# Altium schematic sheet 稳压板STM32.SchDoc
size A2
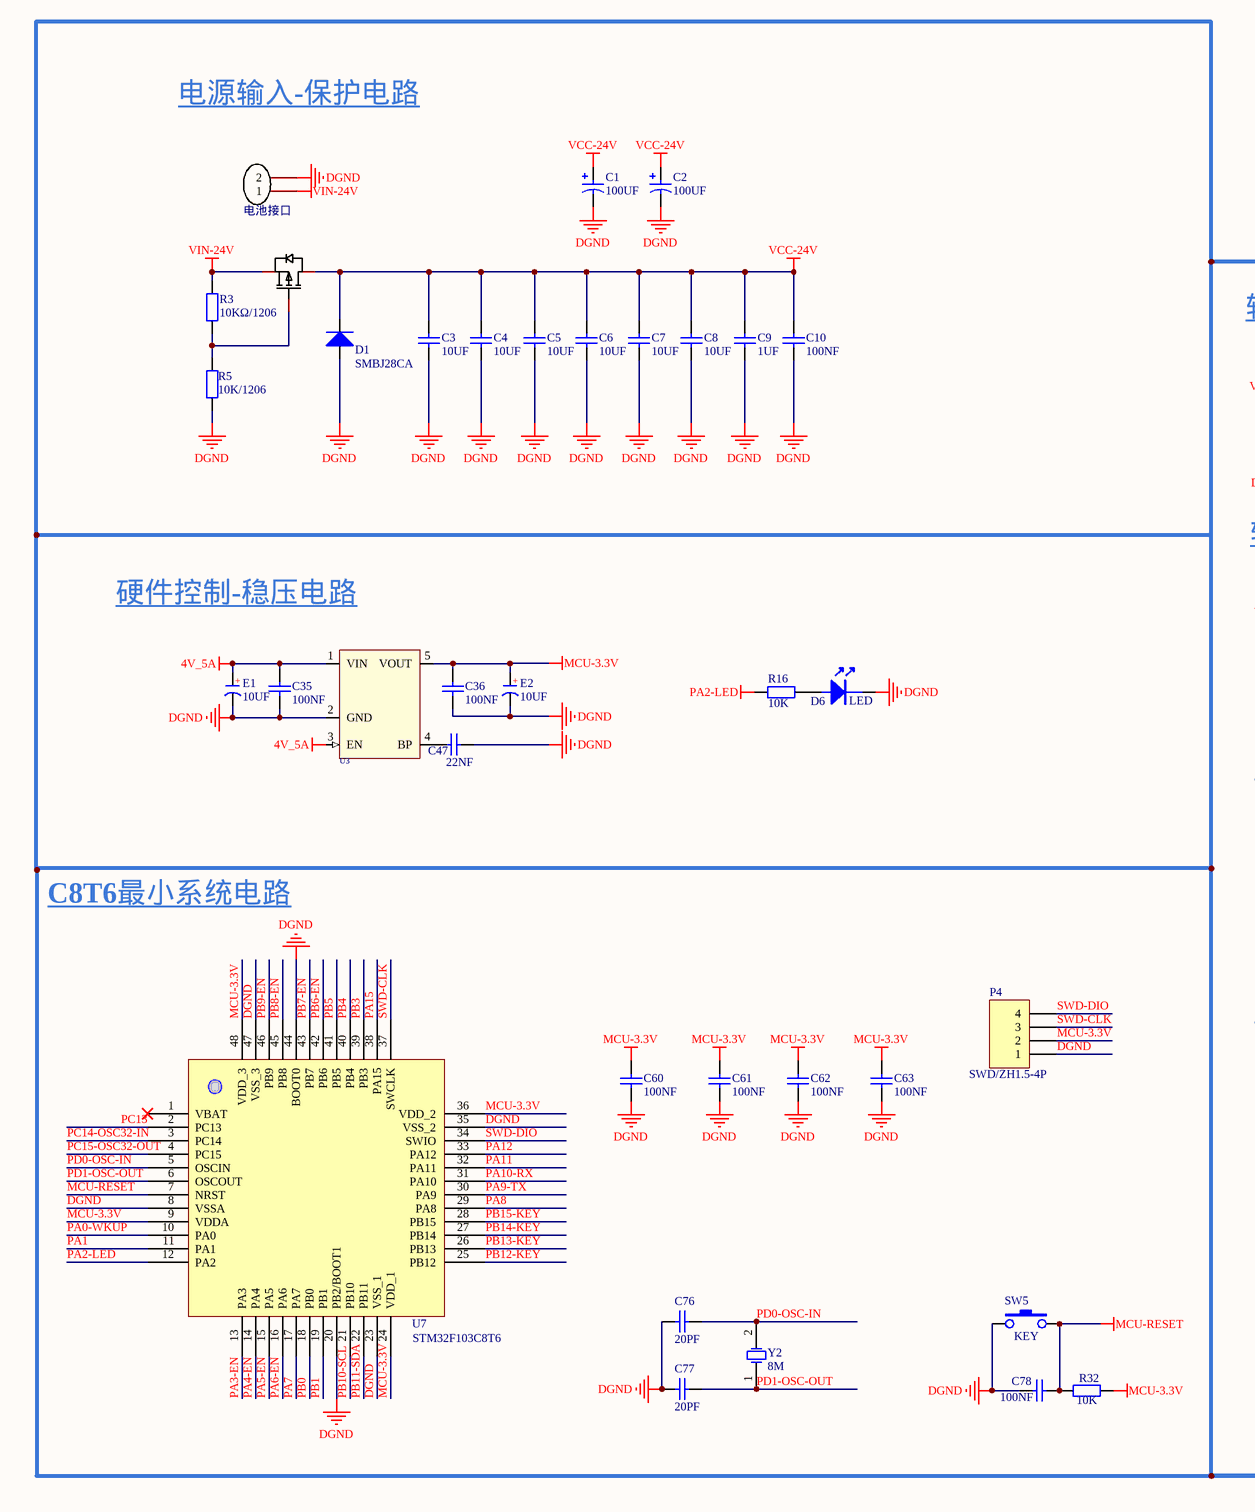
[diagram p0: 稳压板STM32.SchDoc, left]
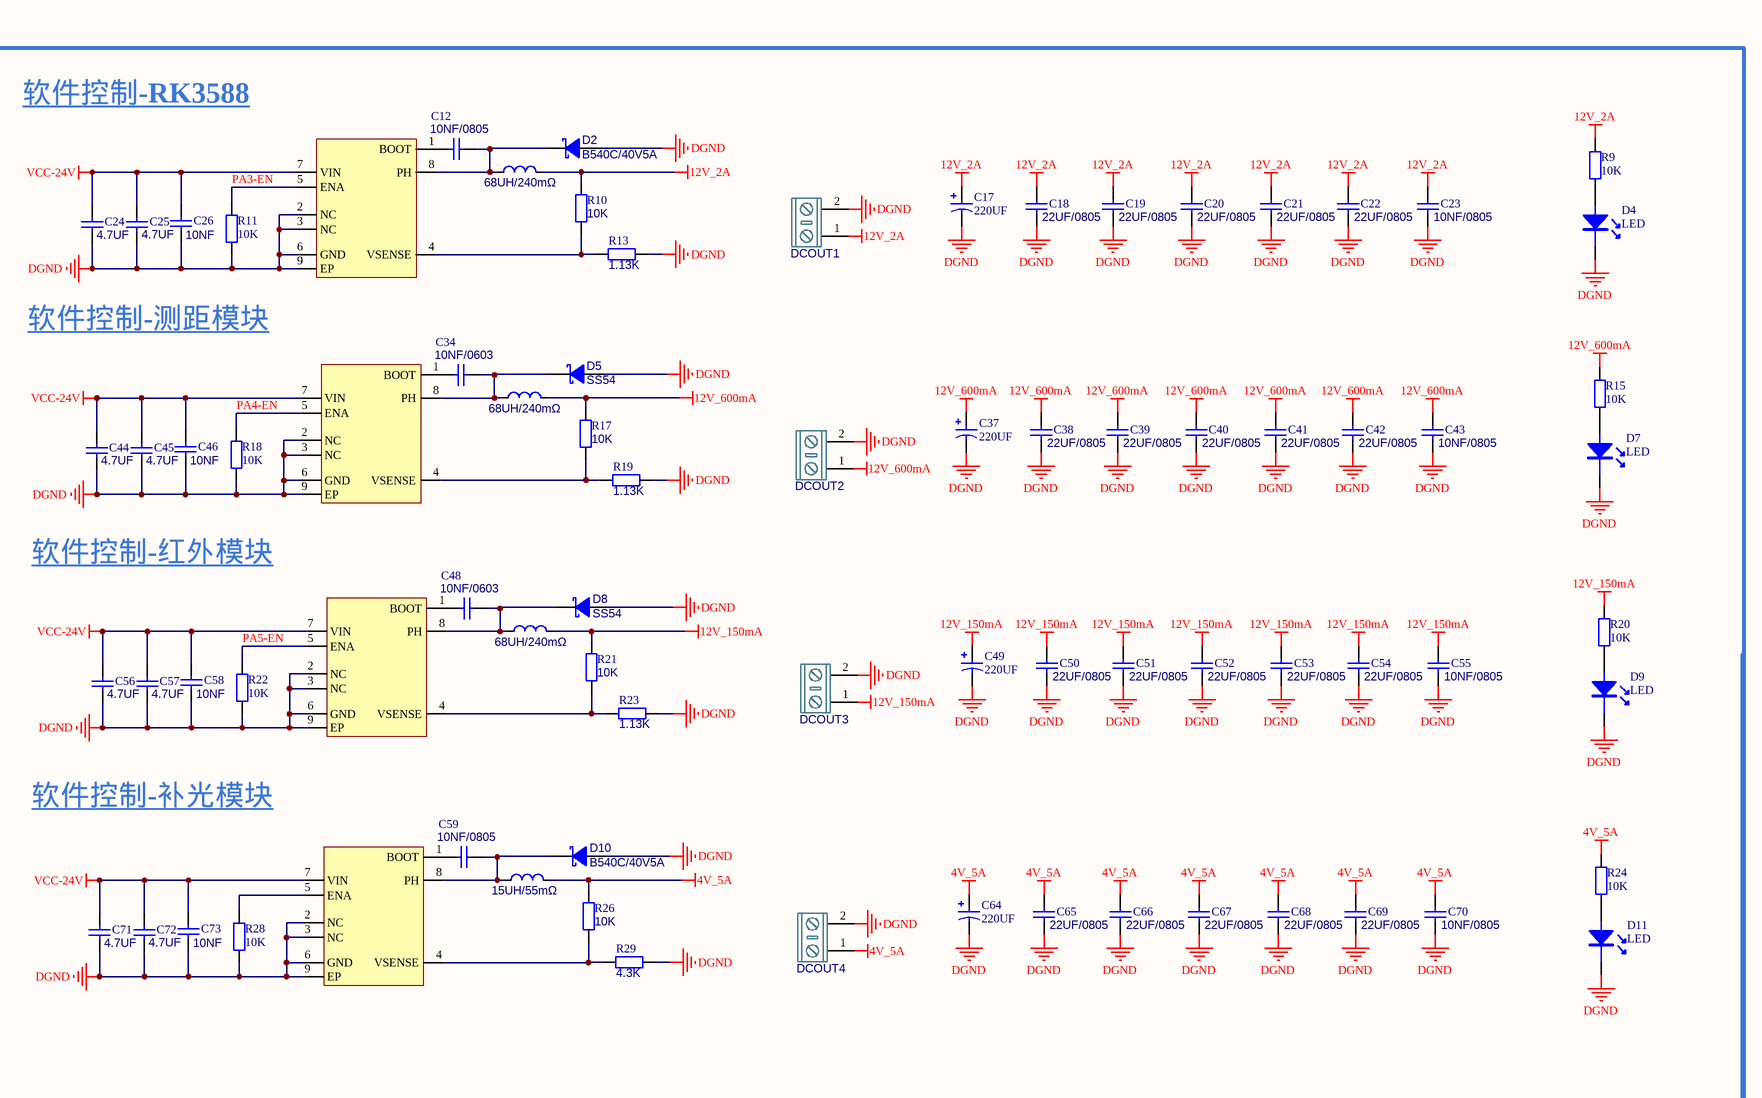
[diagram p1: 稳压板STM32.SchDoc, right]

## Parts
1  68UH/240mΩ  [IND-SMD_L11.5-W10.0_SMMS1040]
3  68UH/240mΩ  [IND-SMD_L11.5-W10.0_SMMS1040]
4  68UH/240mΩ  [IND-SMD_L11.5-W10.0_SMMS1040]
5  15UH/55mΩ  [IND-SMD_L11.5-W10.0_SMMS1040]
C1  100UF  [CM D(6.3*7.7)]
C2  100UF  [CM D(6.3*7.7)]
C3  10UF  [C0603]
C4  10UF  [C0603]
C5  10UF  [C0603]
C6  10UF  [C0603]
C7  10UF  [C0603]
C8  10UF  [C0603]
C9  1UF  [C0603]
C10  100NF  [C0603]
C12  10NF/0805  [C0805]
C17  220UF  [CM F(10*10.2)]
C18  22UF/0805  [C0805]
C19  22UF/0805  [C0805]
C20  22UF/0805  [C0805]
C21  22UF/0805  [C0805]
C22  22UF/0805  [C0805]
C23  10NF/0805  [C0805]
C24  4.7UF  [C1812]
C25  4.7UF  [C1812]
C26  10NF  [C0805]
C34  10NF/0603  [C0603]
C35  100NF  [C0603]
C36  100NF  [C0603]
C37  220UF  [CM F(10*10.2)]
C38  22UF/0805  [C0805]
C39  22UF/0805  [C0805]
C40  22UF/0805  [C0805]
C41  22UF/0805  [C0805]
C42  22UF/0805  [C0805]
C43  10NF/0805  [C0805]
C44  4.7UF  [C0603]
C45  4.7UF  [C0603]
C46  10NF  [C0603]
C47  22NF  [C0603]
C48  10NF/0603  [C0603]
C49  220UF  [CM F(10*10.2)]
C50  22UF/0805  [C0805]
C51  22UF/0805  [C0805]
C52  22UF/0805  [C0805]
C53  22UF/0805  [C0805]
C54  22UF/0805  [C0805]
C55  10NF/0805  [C0805]
C56  4.7UF  [C0603]
C57  4.7UF  [C0603]
C58  10NF  [C0603]
C59  10NF/0805  [C0805]
C60  100NF  [C0603]
C61  100NF  [C0603]
C62  100NF  [C0603]
C63  100NF  [C0603]
C64  220UF  [CM F(10*10.2)]
C65  22UF/0805  [C0805]
C66  22UF/0805  [C0805]
C67  22UF/0805  [C0805]
C68  22UF/0805  [C0805]
C69  22UF/0805  [C0805]
C70  10NF/0805  [C0805]
C71  4.7UF  [C1812]
C72  4.7UF  [C1812]
C73  10NF  [C0805]
C76  20PF  [C0603]
C77  20PF  [C0603]
C78  100NF  [C0603]
D1  SMBJ28CA  [SMB]
D2  B540C/40V5A  [SMC]
D4  LED  [LEDC1608(0603)-L]
D5  SS54  [SMA]
D6  LED  [LEDC1608(0603)-L]
D7  LED  [LEDC1608(0603)-L]
D8  SS54  [SMA]
D9  LED  [LEDC1608(0603)-L]
D10  B540C/40V5A  [SMC]
D11  LED  [LEDC1608(0603)-L]
DCOUT1  KF/WJ/DG 30x connecter  [KF128-5.08-2P]  (value not drawn)
DCOUT2  KF/WJ/DG 30x connecter  [KF128-5.08-2P]  (value not drawn)
DCOUT3  KF/WJ/DG 30x connecter  [KF128-5.08-2P]  (value not drawn)
DCOUT4  KF/WJ/DG 30x connecter  [KF128-5.08-2P]  (value not drawn)
E1  10UF  [CD A(3216)]
E2  10UF  [CD A(3216)]
P1  电池接口  [CONN-TH_2P-P7.62_L15.2-W16.7-EX4.2]
P4  SWD/ZH1.5-4P  [ZH1.5-LI-4P]
Q2  IRF9540NSTRLPBF  [TO263-2]  (value not drawn)
R3  10KΩ/1206  [R1206]
R5  10K/1206  [R1206]
R9  10K  [R0805]
R10  10K  [R0805]
R11  10K  [R0805]
R13  1.13K  [R0805]
R15  10K  [R0805]
R16  10K  [R0805]
R17  10K  [R0805]
R18  10K  [R0805]
R19  1.13K  [R0805]
R20  10K  [R0805]
R21  10K  [R0805]
R22  10K  [R0805]
R23  1.13K  [R0805]
R24  10K  [R0805]
R26  10K  [R0805]
R28  10K  [R0805]
R29  4.3K  [R0805]
R32  10K  [R0603]
SW5  KEY  [TSW SMD-3*6*2.5]
U1  TPS5450DDAR  [SOP8]  (value not drawn)
U3  RT9193  [SOT23-5L]  (value not drawn)
U4  TPS5450DDAR  [SOP8]  (value not drawn)
U5  TPS5450DDAR  [SOP8]  (value not drawn)
U6  TPS5450DDAR  [SOP8]  (value not drawn)
U7  STM32F103C8T6  [TQFP48 7x7_L]
Y2  8M  [OSC 5032-2P]

## Nets
4V_5A: 5.2 C35.2 C64.1 C65.1 C66.1 C67.1 C68.1 C69.1 C70.1 DCOUT4.1 E1.1(A) R24.1 R26.2 U3.1(VIN) U3.3(EN)
12V_2A: 1.2 C17.1 C18.1 C19.1 C20.1 C21.1 C22.1 C23.1 DCOUT1.1 R9.1 R10.2
12V_150mA: 4.2 C49.1 C50.1 C51.1 C52.1 C53.1 C54.1 C55.1 DCOUT3.1 R20.1 R21.2
12V_600mA: 3.2 C37.1 C38.1 C39.1 C40.1 C41.1 C42.1 C43.1 DCOUT2.1 R15.1 R17.2
DGND: C1.2 C2.2 C3.2 C4.2 C5.2 C6.2 C7.2 C8.2 C9.2 C10.2 C17.2 C18.2 C19.2 C20.2 C21.2 C22.2 C23.2 C24.1 C25.1 C26.1 C35.1 C36.1 C37.2 C38.2 C39.2 C40.2 C41.2 C42.2 C43.2 C44.1 C45.1 C46.1 C47.1 C49.2 C50.2 C51.2 C52.2 C53.2 C54.2 C55.2 C56.1 C57.1 C58.1 C60.2 C61.2 C62.2 C63.2 C64.2 C65.2 C66.2 C67.2 C68.2 C69.2 C70.2 C71.1 C72.1 C73.1 C76.2 C77.2 C78.1 D1.1(A) D2.1 D4.2 D5.1 D6.2 D7.2 D8.1 D9.2 D10.1 D11.2 DCOUT1.2 DCOUT2.2 DCOUT3.2 DCOUT4.2 E1.2(K) E2.2(K) P1.2 P4.1 R5.1 R11.2 R13.2 R18.2 R19.2 R22.2 R23.2 R28.2 R29.2 SW5.1 U1.2(NC) U1.3(NC) U1.6(GND) U1.9(EP) U3.2(GND) U4.2(NC) U4.3(NC) U4.6(GND) U4.9(EP) U5.2(NC) U5.3(NC) U5.6(GND) U5.9(EP) U6.2(NC) U6.3(NC) U6.6(GND) U6.9(EP) U7.8(VSSA) U7.20(PB2/BOOT1) U7.23(VSS_1) U7.35(VSS_2) U7.44(BOOT0) U7.47(VSS_3)
MCU-3.3V: C36.2 C60.1 C61.1 C62.1 C63.1 E2.1(A) P4.2 R32.2 U3.5(VOUT) U7.9(VDDA) U7.24(VDD_1) U7.36(VDD_2) U7.48(VDD_3)
MCU-RESET: C78.2 R32.1 SW5.2 U7.7(NRST)
PA2-LED: R16.1 U7.12(PA2)
VCC-24V: C1.1 C2.1 C3.1 C4.1 C5.1 C6.1 C7.1 C8.1 C9.1 C10.1 C24.2 C25.2 C26.2 C44.2 C45.2 C46.2 C56.2 C57.2 C58.2 C71.2 C72.2 C73.2 D1.2(K) Q2.4(D) U1.7(VIN) U4.7(VIN) U5.7(VIN) U6.7(VIN)
VIN-24V: P1.1 Q2.3(S) R3.2
PA0-WKUP: U7.10(PA0)
PA1: U7.11(PA1)
PA3-EN: R11.1 U1.5(ENA) U7.13(PA3)
PA4-EN: R18.1 U4.5(ENA) U7.14(PA4)
PA5-EN: R22.1 U5.5(ENA) U7.15(PA5)
PA6-EN: U7.16(PA6)
PA7: U7.17(PA7)
PA8: U7.29(PA8)
PA9-TX: U7.30(PA9)
PA10-RX: U7.31(PA10)
PA11: U7.32(PA11)
PA12: U7.33(PA12)
PA15: U7.38(PA15)
PB0: U7.18(PB0)
PB1: U7.19(PB1)
PB3: U7.39(PB3)
PB4: U7.40(PB4)
PB5: U7.41(PB5)
PB6-EN: U7.42(PB6)
PB7-EN: U7.43(PB7)
PB8-EN: U7.45(PB8)
PB9-EN: U7.46(PB9)
PB10-SCL: U7.21(PB10)
PB11-SDA: U7.22(PB11)
PB12-KEY: U7.25(PB12)
PB13-KEY: U7.26(PB13)
PB14-KEY: U7.27(PB14)
PB15-KEY: U7.28(PB15)
PC13: U7.2(PC13)
PC14-OSC32-IN: U7.3(PC14)
PC15-OSC32-OUT: U7.4(PC15)
PD0-OSC-IN: C76.1 U7.5(OSCIN) Y2.2(OSC2)
PD1-OSC-OUT: C77.1 U7.6(OSCOUT) Y2.1(OSC1)
SWD-CLK: P4.3 U7.37(SWCLK)
SWD-DIO: P4.4 U7.34(SWIO)
Net1_1: 1.1 C12.1 D2.2 U1.8(PH)
Net3_1: 3.1 C34.1 D5.2 U4.8(PH)
Net4_1: 4.1 C48.1 D8.2 U5.8(PH)
Net5_1: 5.1 C59.1 D10.2 U6.8(PH)
NetC12_2: C12.2 U1.1(BOOT)
NetC34_2: C34.2 U4.1(BOOT)
NetC47_2: C47.2 U3.4(BP)
NetC48_2: C48.2 U5.1(BOOT)
NetC59_2: C59.2 U6.1(BOOT)
NetD4_1: D4.1 R9.2
NetD6_1: D6.1 R16.2
NetD7_1: D7.1 R15.2
NetD9_1: D9.1 R20.2
NetD11_1: D11.1 R24.2
NetQ2_1: Q2.1(G) R3.1 R5.2
NetR10_1: R10.1 R13.1 U1.4(VSENSE)
NetR17_1: R17.1 R19.1 U4.4(VSENSE)
NetR21_1: R21.1 R23.1 U5.4(VSENSE)
NetR26_1: R26.1 R29.1 U6.4(VSENSE)
NetR28_1: R28.1 U6.5(ENA)

Not connected (* = marked no-connect by the designer): U7 1(VBAT)*

## Notes on the sheet
- 电源输入-保护电路
- 软件控制-RK3588
- 软件控制-测距模块
- 硬件控制-稳压电路
- 软件控制-红外模块
- C8T6最小系统电路
- 软件控制-补光模块
- (in symbol CT) +

## Library data of the parts
1 3-5 = L?: Manufacturer: PANASONIC(松下); Name: 22uH; Symbol: ETQP5M220YFM; Add into BOM: yes; DC Resistance (DCR): 92mΩ; Tolerance: ±20%; Rated Current: 3A; Value: 22uH; Device: ETQP5M220YFM; LCSC Part Name: 22uH ±20%; Supplier Part: C409635; Manufacturer Part: ETQP5M220YFM; Supplier Footprint: SMD; JLCPCB Part Class: Extended Part; Datasheet: https://atta.szlcsc.com/upload/public/pdf/source/20190806/C409635_F1A42C1BAB8E9A86103022C3FEB3B8D2.pdf; Supplier: LCSC; Convert to PCB: yes; Height: 5.4mm; Width: 7mm; Length: 7.5mm
  1 3 4: ComponentLink1Description: 68UH/3A; ComponentLink1URL: https://item.szlcsc.com/509547.html
  5: ComponentLink1Description: 15UH/6A; ComponentLink1URL: https://item.szlcsc.com/160930.html
C1 C2 C17 C37 C49 C64 = Cap Pol: 有极性电容; Published: 8-Jun-2000; LatestRevisionDate: 17-Jul-2002; LatestRevisionNote: Re-released for DXP Platform.; PackageReference: RB7.6-15; Publisher: Altium Limited; PackageDescription: Polarized Capacitor (Radial); 2 Leads
  C1 C2: Value: 100UF
  C17 C37 C49 C64: Value: 220UF; ComponentLink1Description: 220UF/50V; ComponentLink1URL: https://item.szlcsc.com/3103839.html
C3-C10 C12 C18-C26 C34-C36 C38-C48 C50-C63 C65-C73 C76-C78 = Cap: Capacitor; Value: 104; Published: 8-Jun-2000; LatestRevisionDate: 17-Jul-2002; LatestRevisionNote: Re-released for DXP Platform.; Publisher: Altium Limited
  C18-C22 C38-C42 C50-C54 C65-C69: ComponentLink1Description: 22UF/25V; ComponentLink1URL: https://item.szlcsc.com/46786.html
D1 = TVS: TVS保护; Type: E6.8CA; Published: 8-Jun-2000; LatestRevisionDate: 17-Jul-2002; LatestRevisionNote: Re-released for DXP Platform.; PackageDocument: Sep-1996; PackageReference: SMC; Publisher: Altium Limited; Code_JEDEC: DO-214-AB; ComponentLink1Description: TVS二极管; ComponentLink1URL: https://item.szlcsc.com/6097556.html
D2 D5 D8 D10 = SS54: SS54 肖特基二极管; Revision: V1.0
  D2 D10: Value: B540C/40V5A; ComponentLink1Description: B540C; ComponentLink1URL: https://item.szlcsc.com/73373.html
  D5 D8: Value: SS54
DCOUT1-DCOUT4 = KF/WJ/DG 30x: 接线端子 2Pin
E1 E2 = CT: 贴片钽电容; 淘宝ID: 封装库来自淘宝 ID：黄晶宝石; BOM名称: 贴片钽电容; 联系售后: https://shop463601444.taobao.com
P1 = WJ500V-5.08-2P-接线端子: Manufacturer: KANGNEX(康奈克斯电气); Symbol: WJ500V-5.08-2P-14-00A; Add into BOM: yes; Pitch: 5.08mm; Structure: 1x2P; Number of PINs Per Row: 2; Current Rating (Max): 18A; Voltage Rating (Max): 250V; Wire Gauge - AWG: 14~30; Wire Gauge - mm2: 2.5; Name: WJ500V-5.08-2P; Device: WJ500V-5.08-2P; LCSC Part Name: 5.08mm 1x2P 排数:1 每排P数:2 直针 可拼接; Supplier Part: C8465; Manufacturer Part: WJ500V-5.08-2P; Supplier Footprint: 插件,P=5.08mm; JLCPCB Part Class: Extended Part; Datasheet: https://atta.szlcsc.com/upload/public/pdf/source/20191225/C8465_02D34CE5B5B4A53DF5891601D97FA9F4.pdf; Supplier: LCSC; Convert to PCB: yes; Number of Rows: 1; Mounting Style: 直针; Operating Temperature Range: -40℃~+105℃; Color: 绿色; ComponentLink1Description: 立创商城-接线端子2P; ComponentLink1URL: https://item.szlcsc.com/8959.html
P4 = Header 4: Header, 4-Pin; LatestRevisionDate: 17-Jul-2002; LatestRevisionNote: Re-released for DXP Platform.; Publisher: Altium Limited
Q2 = IRF9540NSTRLPBF: Manufacturer: Infineon(英飞凌); Add into BOM: yes; Type: P沟道; Drain Source Voltage (Vdss): 100V; Continuous Drain Current (Id): 23A; Power Dissipation (Pd): 3.1W；110W; Drain Source On Resistance (RDS(on)@Vgs,Id): 117mΩ@10V,14A; Gate Threshold Voltage (Vgs(th)@Id): 4V@250uA; Total Gate Charge (Qg@Vgs): 110nC@10V; Input Capacitance (Ciss@Vds): 1.45nF@25V; Name: IRF9540NSTRLPBF; Symbol: IRF9540NSTRLPBF; Device: IRF9540NSTRLPBF; LCSC Part Name: P沟道 100V 23A; Supplier Part: C33903; Manufacturer Part: IRF9540NSTRLPBF; Supplier Footprint: D2PAK; JLCPCB Part Class: Extended Part; Datasheet: https://atta.szlcsc.com/upload/public/pdf/source/20150915/1457707369947.pdf; Supplier: LCSC; Convert to PCB: yes; Operating Temperature: -55℃~+150℃@(Tj); ComponentLink1Description: 立创商城-PMOS-100V23A; ComponentLink1URL: https://item.szlcsc.com/34871.html
R3 R5 R9-R11 R13 R15-R24 R26 R28 R29 R32 = Res2: Resistor; Published: 8-Jun-2000; LatestRevisionDate: 17-Jul-2002; LatestRevisionNote: Re-released for DXP Platform.; Publisher: Altium Limited
SW5 = SW-PB_V: SWITCH
U1 U4-U6 = TPS5450DDAR: Manufacturer: TI(德州仪器); Add into BOM: yes; Function: 降压型; Synchronous Rectification: 否; Output Type: 可调; Number of Outputs: 1; Topology: 降压式; Input Voltage: 5.5V~36V; Output Voltage: 1.221V~31.32V; Output Current (Max): 5A; Switching Frequency: 500kHz; Name: TPS5450DDAR; Symbol: TPS5450DDAR; Device: TPS5450DDAR; LCSC Part Name: 降压型 Vin=5.5V~36V Vout=1.221V~31.32V 5A; Supplier Part: C114425; Manufacturer Part: TPS5450DDAR; Supplier Footprint: SOP-8-EP; JLCPCB Part Class: Extended Part; Datasheet: https://atta.szlcsc.com/upload/public/pdf/source/20170620/1497944765773.pdf; Supplier: LCSC; Convert to PCB: yes; Operating Temperature: -40℃~+125℃@(TJ)
U3 = RT9193X_5P: ICA_MFR_NAME: RICHTEK; ICA_PARTNUM: $$2191094$$RT9193-15CU5; Part Number: TMP-13
Y2 = XTAL: Crystal Oscillator; Published: 8-Jun-2000; LatestRevisionDate: 17-Jul-2002; LatestRevisionNote: Re-released for DXP Platform.; Publisher: Altium Limited